# Altium schematic sheet PC1_Codec.SchDoc
size 199 x 149 mm
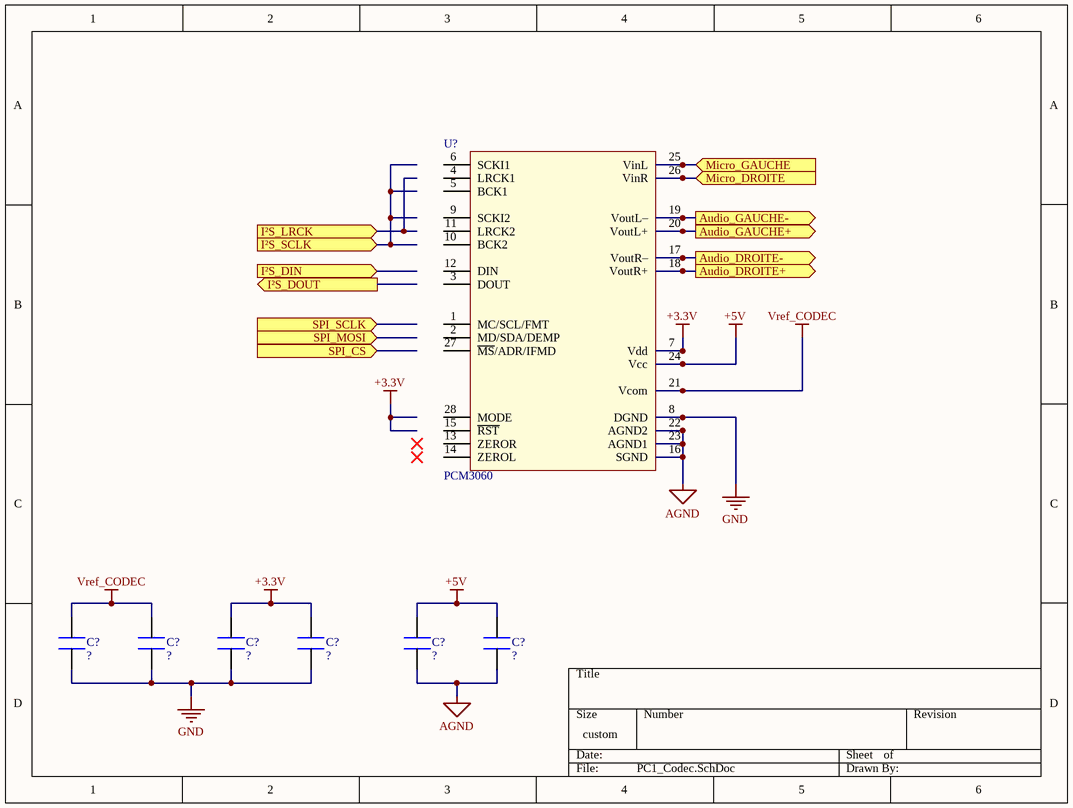
[diagram p0: PC1_Codec.SchDoc]

## Parts
(Parts that share a designator on the sheet are numbered #1, #2 ... from top to bottom, then left to right.)
C?#1  Condo  (value not drawn)  (no BOM)
C?#2  Condo  (value not drawn)  (no BOM)
C?#3  Condo  (value not drawn)  (no BOM)
C?#4  Condo  (value not drawn)  (no BOM)
C?#5  Condo  (value not drawn)  (no BOM)
C?#6  Condo  (value not drawn)  (no BOM)
U?  PCM3060

## Ports
Audio_DROITE+ (out), Audio_DROITE- (out), Audio_GAUCHE+ (out), Audio_GAUCHE- (out), I²S_DIN (in), I²S_DOUT (out), I²S_LRCK (in), I²S_SCLK (in), Micro_DROITE (in), Micro_GAUCHE (in), SPI_CS (in), SPI_MOSI (in), SPI_SCLK (in)

## Nets
+3.3V: C?#3.2 C?#4.2 U?.7(Vdd)
+5V: C?#5.2 C?#6.2 U?.24(Vcc)
AGND: C?#5.1 C?#6.1 U?.16(SGND) U?.22(AGND2) U?.23(AGND1)
GND: C?#1.1 C?#2.1 C?#3.1 C?#4.1 U?.8(DGND)
Vref_CODEC: C?#1.2 C?#2.2 U?.21(Vcom)
Audio_DROITE+: U?.18(VoutR+) ; port Audio_DROITE+
Audio_DROITE-: U?.17(VoutR–) ; port Audio_DROITE-
Audio_GAUCHE+: U?.20(VoutL+) ; port Audio_GAUCHE+
Audio_GAUCHE-: U?.19(VoutL–) ; port Audio_GAUCHE-
Micro_DROITE: U?.26(VinR) ; port Micro_DROITE
Micro_GAUCHE: U?.25(VinL) ; port Micro_GAUCHE

Not connected (* = marked no-connect by the designer): U? 1(MC/SCL/FMT) 2(MD/SDA/DEMP) 3(DOUT) 4(LRCK1) 5(BCK1) 6(SCKI1) 9(SCKI2) 10(BCK2) 11(LRCK2) 12(DIN) 13(ZEROR) 14(ZEROL) 15(~{RST}) 27(~{MS}/ADR/IFMD) 28(MODE)

## Library data of the parts
C?#1-C?#6 = Condo: Condensateur; Valeur: ?
U? = PCM3060: Stéréo In/Out Audio Codec; Fabricant: TEXAS INSTRUMENTS; RefFabricant: PCM3060PW; Datasheet: http://www.ti.com/lit/ds/symlink/pcm3060.pdf